# EAGLE design tiny13_charlie4_50mm_boosted (EAGLE 6.2)
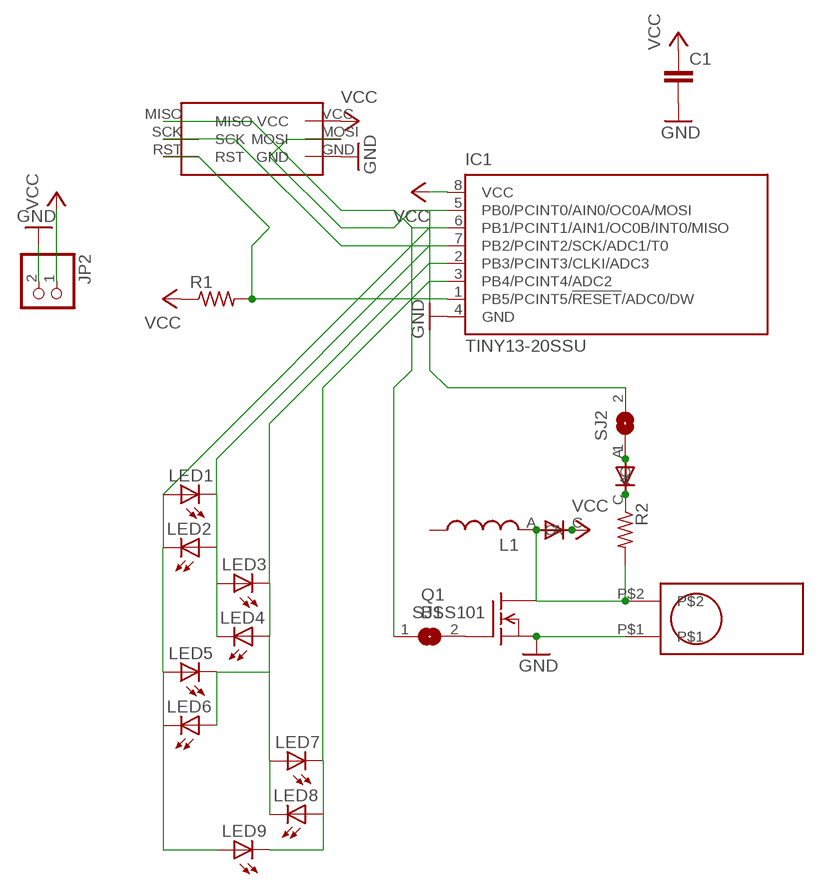
[diagram p0: schematic, sheet 1]

## Parts
C1  C-EU025-025X050  [C025-025X050]
IC1  TINY13-20SSU  [8S1]
JP2  PINHD-1X2/90  [1X02/90]
L1  L-US0207/7  [0207/7]
LED1  LED3MM  [LED3MM]
LED2  LED3MM  [LED3MM]
LED3  LED3MM  [LED3MM]
LED4  LED3MM  [LED3MM]
LED5  LED3MM  [LED3MM]
LED6  LED3MM  [LED3MM]
LED7  LED3MM  [LED3MM]
LED8  LED3MM  [LED3MM]
LED9  LED3MM  [LED3MM]
Q1  BSS101  [TO92]
R1  R-US_0207/7  [0207/7]
R2  R-US_0207/7  [0207/7]
SJ1  SJ  [SJ]
SJ2  SJ  [SJ]
U$1  TILT_SWITCH_MECHANICAL  [TILT_SWITCH_MECHANICAL]
U$2  AVR_ISP_6_PIN_1X6_SMT_CONTACT_PROGRAMMER  [CONTACT_ISP_PROGRAMMER_1X6_ATMEL]
U$3  D-6  [D-7.5]
U$4  D-6  [D-7.5]

## Nets
GND: C1.2 IC1.4(GND) JP2.2 Q1.1(S) U$1.P$1 U$2.GND
N$1: IC1.2(PB3/PCINT3/CLKI/ADC3) LED3.K(C) LED4.A LED5.K(C) LED6.A LED7.A LED8.K(C)
N$2: IC1.7(PB2/PCINT2/SCK/ADC1/T0) LED1.K(C) LED2.A LED3.A LED4.K(C) U$2.SCK
N$3: L1.2 Q1.3(D) R2.2 U$1.P$2 U$3.A
N$4: IC1.3(PB4/PCINT4/ADC2) LED7.K(C) LED8.A LED9.K(C)
N$5: R2.1 U$4.C
N$6: IC1.1(PB5/PCINT5/!RESET!/ADC0/DW) R1.2 U$2.RST
N$7: IC1.5(PB0/PCINT0/AIN0/OC0A/MOSI) SJ2.2 U$2.MOSI
N$8: IC1.6(PB1/PCINT1/AIN1/OC0B/INT0/MISO) LED1.A LED2.K(C) LED5.A LED6.K(C) LED9.A SJ1.1 U$2.MISO
N$9: Q1.2(G) SJ1.2
N$10: SJ2.1 U$4.A
VCC: C1.1 IC1.8(VCC) JP2.1 R1.1 U$2.VCC U$3.C
Unconnected: L1.1

## Library data of the parts
C1 = resistor:C-EU: CAPACITOR, European symbol
IC1 = atmel:TINY13: 8-bit AVR Microcontroller with 1K Bytes In-System Programmable Flash Source: http://www.atmel.com/dyn/resources/prod_documents/2535S.pdf; MPN: ATTINY13-20SSU; OC_FARNELL: 1455133; OC_NEWARK: 58M3771
JP2 = pinhead:PINHD-1X2: PIN HEADER
L1 = resistor:L-US: INDUCTOR, American symbol
LED1-LED9 = 0-svo:LED: LED OSRAM: - CHIPLED LG R971, LG N971, LY N971, LG Q971, LY Q971, LO R971, LY R971 LH N974, LH R974 LS Q976, LO Q976, LY Q976 LO Q996 - Hyper CHIPLED LW Q18S LB Q993, LB Q99A, LB R99A - SideLED LS A670, LO A670, LY A670, LG A670, LP A670 LB A673, LV A673, LT A673, LW A673 LH A674 LY A675 LS A676, LA A676, LO A676, LY A676, LW A676 LS A679, LY A679, LG A679 - Hyper Micro SIDELED® LS Y876, LA Y876, LO Y876, LY Y876 LT Y87S - SmartLED LW L88C, LW L88S LB L89C, LB L89S, LG L890 LS L89K, LO L89K, LY L89K LS L896, LA L896, LO L896, LY L896 - TOPLED LS T670, LO T670, LY T670, LG T670, LP T670 LSG T670, LSP T670, LSY T670, LOP T670, LYG T670 LG T671, LOG T671, LSG T671 LB T673, LV T673, LT T673, LW T673 LH T674 LS T676, LA T676, LO T676, LY T676, LB T676, LH T676, LSB T676, LW T676 LB T67C, LV T67C, LT T67C, LS T67K, LO T67K, LY T67K, LW E67C LS E67B, LA E67B, LO E67B, LY E67B, LB E67C, LV E67C, LT E67C LW T67C LS T679, LY T679, LG T679 LS T770, LO T770, LY T770, LG T770, LP T770 LB T773, LV T773, LT T773, LW T773 LH T774 LS E675, LA E675, LY E675, LS T675 LS T776, LA T776, LO T776, LY T776, LB T776 LHGB T686 LT T68C, LB T68C - Hyper Mini TOPLED® LB M676 - Mini TOPLED Santana® LG M470 LS M47K, LO M47K, LY M47K Source: http://www.osram.convergy.de/
Q1 = transistor-fet:BSS101: N-Channel Enhancement MOSFET 200V; 0,16A; 11Ohm
R1 R2 = resistor:R-US_: RESISTOR, American symbol
SJ1 SJ2 = jumper:SJ: SMD solder JUMPER
U$1 = Mrule:TILT_SWITCH_MECHANICAL
U$2 = Mrule:AVR_ISP_6_PIN_1X6_SMT_CONTACT_PROGRAMMER
U$3 U$4 = Mrule:D-6

## Board
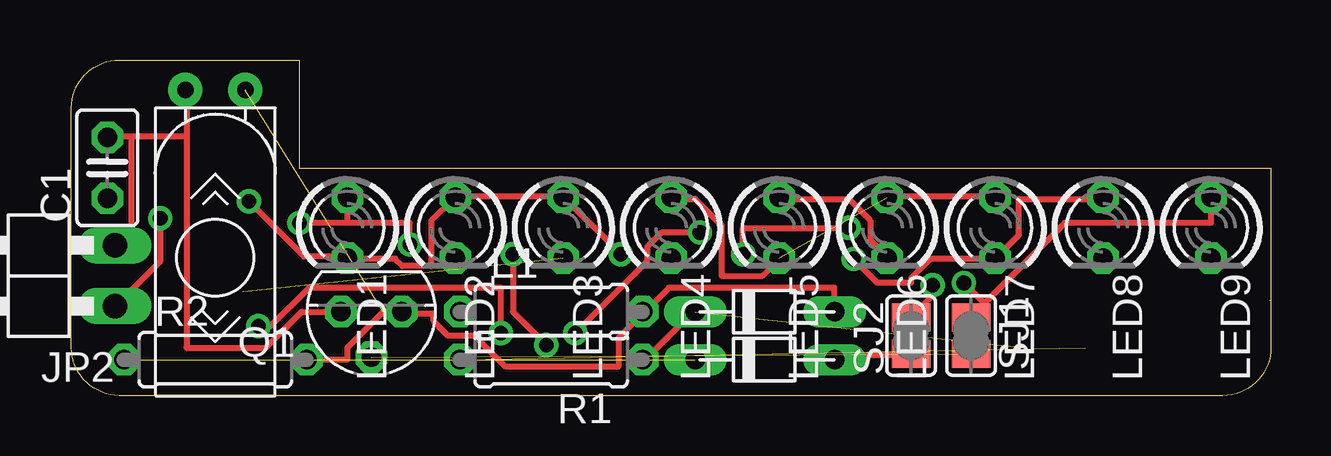
[diagram p1: board, top side]
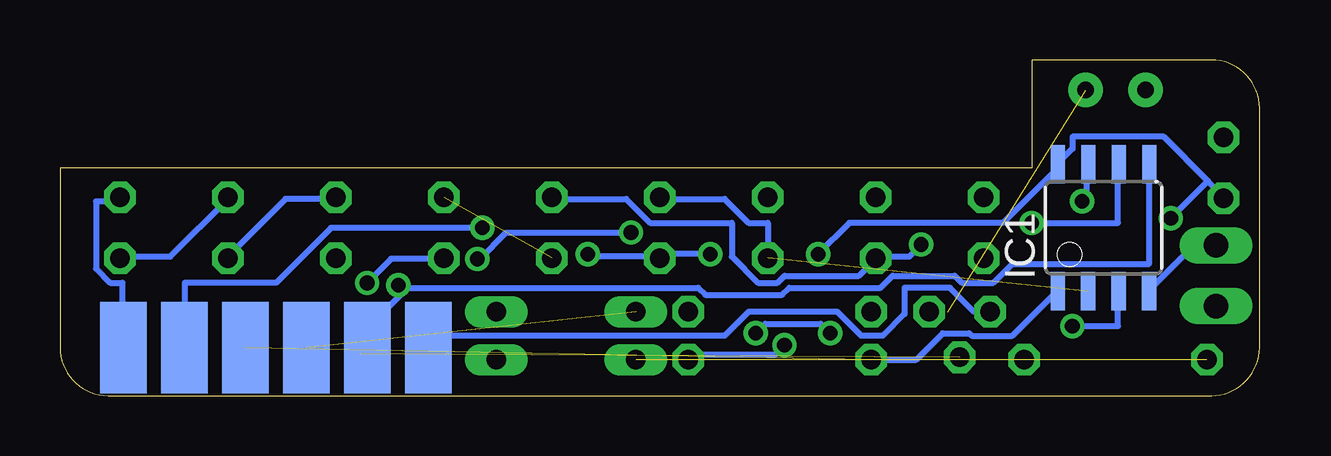
[diagram p2: board, bottom side, seen from below]

Size 50 x 14 mm. Coordinates in mm from the lower left corner, seen from the top.
Outline: 49.96,4 50,4
Outline: 50,4 50,9.5 9.5,9.5 9.5,14 2,14 arc90 0,12 0,2 arc90 2,0 48,0 arc90 50,2 50,4
Copper layers (1*16): Top 0.035mm / dielectric 1.5mm / Bottom 0.035mm
Design rules: minimum track width 10mil, minimum drill 24mil, track to track 8mil, track to pad 8mil, pad to pad 8mil, via to via 8mil, smd to smd 8mil, copper to edge 40mil, drill to drill 8mil, minimum pad ring 10mil, minimum via ring 8mil, stop-mask expansion 4mil, vias tented up to drill 0mil, thermal gap 10mil

### Footprints (pad centres in the part's own frame; a part is rotated, then mirrored left to right if it is on the bottom)
C025-025X050 = drill 0.813 octagon: 1 -1.27,0; 2 1.27,0
8S1 = smd 0.6 x 1.6: 1 -1.905,-2.654; 2 -0.645,-2.654; 3 0.625,-2.654; 4 1.895,-2.654; 5 1.905,2.654; 6 0.635,2.654; 7 -0.635,2.654; 8 -1.905,2.654
1X02/90 = drill 1.016 long: 1 -1.27,-3.81; 2 1.27,-3.81
0207/7 = drill 0.813 octagon: 1 -3.81,0; 2 3.81,0
LED3MM = drill 0.813 octagon: A -1.27,0; K 1.27,0
TO92 = drill 0.813 octagon: 1 1.27,0; 2 0,1.905; 3 -1.27,0
SJ = smd 1.168 x 1.6: 1 -0.762,0; 2 0.762,0
TILT_SWITCH_MECHANICAL = drill 0.7 pad 1.422: P$1 -0.75,1.25; P$2 -0.75,3.75
CONTACT_ISP_PROGRAMMER_1X6_ATMEL = smd 1.93 x 3.81: GND 6.35,0; MISO -6.35,0; MOSI 3.81,0; RST -1.27,0; SCK -3.81,0; VCC 1.27,0
D-7.5 = drill 0.813 long: A 2.81,0; C -3,0

### Placement (x,y rotation side)
C1  1.5,9.5 90 top
IC1  6.5,7 0 bottom
JP2  -2,5 90 top
L1  20,3.5 0 top
LED1  11.5,7 270 top
LED2  16,7 270 top
LED3  20.5,7 270 top
LED4  25,7 270 top
LED5  29.5,7 270 top
LED6  34,7 270 top
LED7  38.5,7 270 top
LED8  43,7 270 top
LED9  47.5,7 270 top
Q1  12.5,3.5 180 top
R1  20,1.5 180 top
R2  6,1.5 0 top
SJ1  37.5,2.5 270 top
SJ2  35,2.5 90 top
U$1  3.5,12 270 top
U$2  41,2 0 bottom
U$3  29,3.5 0 top
U$4  29,1.5 0 top

### Tracks (layer width: path | path; a pad name or v marks a point on that pad's centre or on a via)
GND
  Top 0.254: Q1.1 9.6,3.5 8.1,2 4.8,2 4.8,10.8 | 4.8,10.8 4.8,12.7 U$1.P$1 | 4.8,10.8 2.5,10.8 | 2.5,10.8 1.5,10.8 C1.2 | 2.5,10.8 2.5,6.9 1.9,6.3 JP2.2
  Bottom 0.254: IC1.4 4.6,4.4 2.8,6.2 1.9,6.2 JP2.2 | Q1.1 11.9,3.5 12.9,4.5 14.8,4.5 14.8,3.4 15.7,2.5 16.6,2.5 17.6,3.5 21.3,3.5 22.3,2.5 34.1,2.5 34.6,2 U$2.GND
N$1  (2 unrouted)
  Top 0.254: LED5.K 29.5,5.7 28.8,5 27.1,5 27.1,7.1 26,8.2 25,8.2 LED4.A | LED6.A 34,8.3 38.5,8.3 LED7.A
  Bottom 0.254: LED3.K 20.5,7.2 21.3,7.2 22.3,8.2 25,8.2 LED4.A | LED8.K 43,5.8 40.6,8.2 38.5,8.2 LED7.A
N$2  (via drill 0.61)
  Top 0.254: v7.4,8.1 9.7,5.8 11.5,5.8 LED1.K 11.6,5.7 13.5,5.7 13.8,5.4 15,5.4 15,7.3 15.9,8.2 LED2.A 16,8.3 20.5,8.3 LED3.A 20.6,8.2 v22.9,5.9 | v32.4,7 28,7 v28,5.9
  Bottom 0.254: v7.4,8.1 7.2,8.1 7.2,9.6 IC1.7 | v22.9,5.9 24.9,5.9 25,5.8 LED4.K 25.1,5.8 27.9,5.8 v28,5.9 | v32.4,7 38.7,7 41,4.7 44.8,4.7 U$2.SCK
N$3  (1 unrouted)
  Top 0.254: R2.2 11.5,1.5 11.5,2 13,3.5 Q1.3 13.8,3.4 15.1,3.4 15.1,3.1 15.7,2.5 17,2.5 17,2.3 18.1,1.2 22.8,1.2 22.8,2.4 23.8,3.4 L1.2 23.9,3.5 24.9,4.5 31.8,4.5 U$3.A
N$4  (via drill 0.61)
  Top 0.254: v7.8,2.9 8.3,2.9 9.9,4.5 17.9,4.5 v17.9,2.6 | v21,2.6 24,5.6 24,6.2 24.6,6.8 v26.2,6.8 | v32.6,5.7 33.6,4.7 35,4.7 35,4.9 35.8,5.7 38.5,5.7 LED7.K 38.6,5.8 39.5,6.7 39.5,8.2 43,8.2 LED8.A
  Bottom 0.254: LED8.A 43,8.2 45.4,5.8 47.5,5.8 LED9.K | v7.8,2.9 5.9,2.9 5.9,4.3 IC1.3 | v17.9,2.6 18.3,3 20.6,3 v21,2.6 | v26.2,6.8 31.4,6.8 32.5,5.7 v32.6,5.7
N$5  (1 unrouted)
N$6  (1 unrouted)
  Bottom 0.254: R1.2 14.3,1.5 13.2,2.6 12.1,2.6 12,2.5 10.3,2.5 8.5,4.3 IC1.1
N$7  (via drill 0.61)
  Top 0.254: v35.9,4.6 35.9,4.2 35,3.3 SJ2.2
  Bottom 0.254: 35.65,4.35 37.1,2.9 37.1,2 U$2.MOSI | 35.65,4.35 35.5,4.5 23.4,4.5 23.1,4.2 19.9,4.2 19.6,4.5 15.8,4.5 15.3,5 12.7,5 12.4,4.7 11.1,4.7 10.3,5.5 4.6,5.5 4.6,9.6 IC1.5 | 35.65,4.35 v35.9,4.6
N$8  (via drill 0.61)
  Top 0.254: 38.05,3.85 41.4,7.2 47.5,7.2 LED9.A | 38.05,3.85 37.5,3.3 SJ1.1 | 11.5,7.2 v9.5,7.2 | LED1.A 11.5,7.2 | LED6.K 34,5.8 33.3,6.5 33.3,7.3 32.4,8.2 29.5,8.2 LED5.A | 11.5,7.2 14.1,7.2 v14.1,6.3 | v37.2,4.7 38.05,3.85
  Bottom 0.254: U$2.MISO 47.4,2 47.4,4.7 47.9,4.7 48.5,5.3 48.5,8.1 47.6,8.1 47.5,8.2 LED9.A | v9.5,7.2 5.9,7.2 5.9,9.6 IC1.6 | LED5.A 29.5,8.2 26.4,8.2 25.4,7.2 22,7.2 22,5.8 20.9,4.7 20.1,4.7 19.8,5 16.7,5 16,5.7 LED2.K 15.9,5.8 14.6,5.8 v14.1,6.3 | v37.2,4.7 36.2,5.7 34,5.7 LED6.K
N$9  (1 unrouted)
N$10
  Top 0.254: SJ2.1 35,1.7 31.9,1.7 31.9,1.5 U$4.A
VCC  (via drill 0.61)  (1 unrouted)
  Top 0.254: U$3.C 25.9,3.5 23.9,1.5 R1.1 | v3.7,7.4 3.7,5.6 1.9,3.8 JP2.1 | v19.8,2.1 18.4,3.5 v18.4,5.9
  Bottom 0.254: 2.15,8.95 1.5,8.3 C1.1 | 2.15,8.95 4,10.8 7.8,10.8 7.8,10.3 8.4,9.7 IC1.8 8.3,9.6 10.7,7.2 17.1,7.2 v18.4,5.9 | 2.15,8.95 v3.7,7.4 | v19.8,2.1 20.2,1.7 23.6,1.7 R1.1